# Altium schematic sheet V1.2-扩展板.SchDoc
size 203 x 152 mm
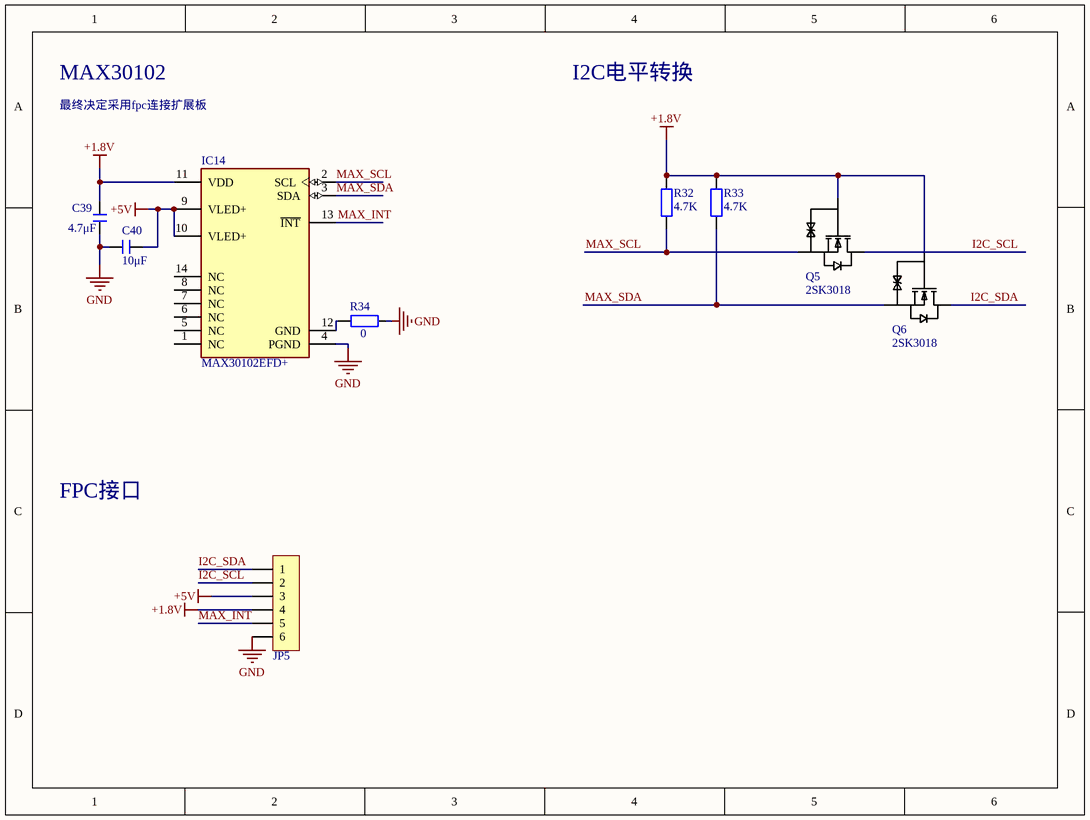
[diagram p0: V1.2-扩展板.SchDoc]

## Parts
C39  4.7μF  [C 0603_L]
C40  10μF  [C 0603_L]
IC14  MAX30102EFD+  [FP-F143A5-1-MFG]
JP5  FPC1.0-6P  [FPC0.5 2H-WS-6P]  (value not drawn)
Q5  2SK3018  [SOT23-3L]
Q6  2SK3018  [SOT23-3L]
R32  4.7K  [R 0603_L]
R33  4.7K  [R 0603_L]
R34  0  [R 0603_L]

## Nets
+1.8V: C39.1 IC14.11(VDD) JP5.4 Q5.1(G) Q6.1(G) R32.1 R33.1
+5V: C40.2 IC14.9(VLED+) IC14.10(VLED+) JP5.3
GND: C39.2 C40.1 IC14.4(PGND) JP5.6 R34.1
I2C_SCL: JP5.2 Q5.3(D)
I2C_SDA: JP5.1 Q6.3(D)
MAX_INT: IC14.13(~{INT}) JP5.5
MAX_SCL: IC14.2(SCL) Q5.2(S) R32.2
MAX_SDA: IC14.3(SDA) Q6.2(S) R33.2
NetIC14_12: IC14.12(GND) R34.2

Not connected (* = marked no-connect by the designer): IC14 1(NC) 5(NC) 6(NC) 7(NC) 8(NC) 14(NC)

## Notes on the sheet
- MAX30102
- I2C电平转换
- 最终决定采用fpc连接扩展板
- FPC接口

## Library data of the parts
C39 C40 = C: 无极性贴片电容; 版权归属: 源创客; BOM名称: 无极性贴片电容; 学习资源: www.ooocke.com
IC14 = MAX30102: IC SENSOR OXIMETER/HEARTRATE; Manufacturer: Maxim Integrated; Max Junction Temp: +90°C; Min Supply Voltage: 1.7V; Sensor Output: I2C; Operating Supply Current: 600uA; Max Supply Voltage: 2V; Package: F143A5-1; Manufacturer Part Number: MAX30102EFD+; Footprint Url: https://pdfserv.maximintegrated.com/land_patterns/90-0602.PDF; ComponentLink2URL: https://datasheets.maximintegrated.com/en/ds/MAX30102.pdf; Temperature: -40°C to +85°C; Device Class L2: unset; Mouser Description: Pulse Oximeter/Heart Rate Sensor, Oesip; Temperature Range High: +85°C; Automotive: No; Height: 1.65mm; Digikey Description: IC SENSOR OXIMETER/HEARTRATE; Category: IC; Lead Free: Yes; RoHS: TRUE; Temperature Range Low: -40°C; ComponentLink2Description: Datasheet; Octopart: https://octopart.com/max30102efd%2B-maxim+integrated-59568799; Device Class L3: unset; Device Class L1: Sensors
JP5 = FPC-6P: FPC连接器; 版权归属: 源创客; BOM名称: FPC连接器; 学习资源: www.ooocke.com
Q5 Q6 = 2SK3018: 类型:-;漏源电压(Vdss):-;连续漏极电流(Id):-;功率(Pd):-;导通电阻(RDS(on)@Vgs,Id):-;阈值电压(Vgs(th)@Id):-;栅极电荷(Qg@Vgs):-;输入电容(Ciss@Vds):-;反向传输电容(Crss@Vds):-;; Manufacturer: TWGMC(台湾迪嘉); Symbol: 2SK3018_C727148; Add into BOM: yes; Device: 2SK3018; LCSC Part Name: 2SK3018; Supplier Part: C727148; Manufacturer Part: 2SK3018; Supplier Footprint: SOT-23; JLCPCB Part Class: Extended Part; Datasheet: https://atta.szlcsc.com/upload/public/pdf/source/20200827/C727148_2301BBDB89FCE642A4A39ABEF7075607.pdf; Supplier: LCSC; Convert to PCB: yes; Type: -; Drain Source Voltage (Vdss): -; Continuous Drain Current (Id): -; Power Dissipation (Pd): -; Drain Source On Resistance (RDS(on)@Vgs,Id): -; Gate Threshold Voltage (Vgs(th)@Id): -; Total Gate Charge (Qg@Vgs): -; Input Capacitance (Ciss@Vds): -; Reverse Transfer Capacitance (Crss@Vds): -
R32-R34 = R: 贴片电阻; 版权归属: 源创客; BOM名称: 贴片电阻; 学习资源: www.ooocke.com